# EAGLE design meaga relay (EAGLE 9.6.2)
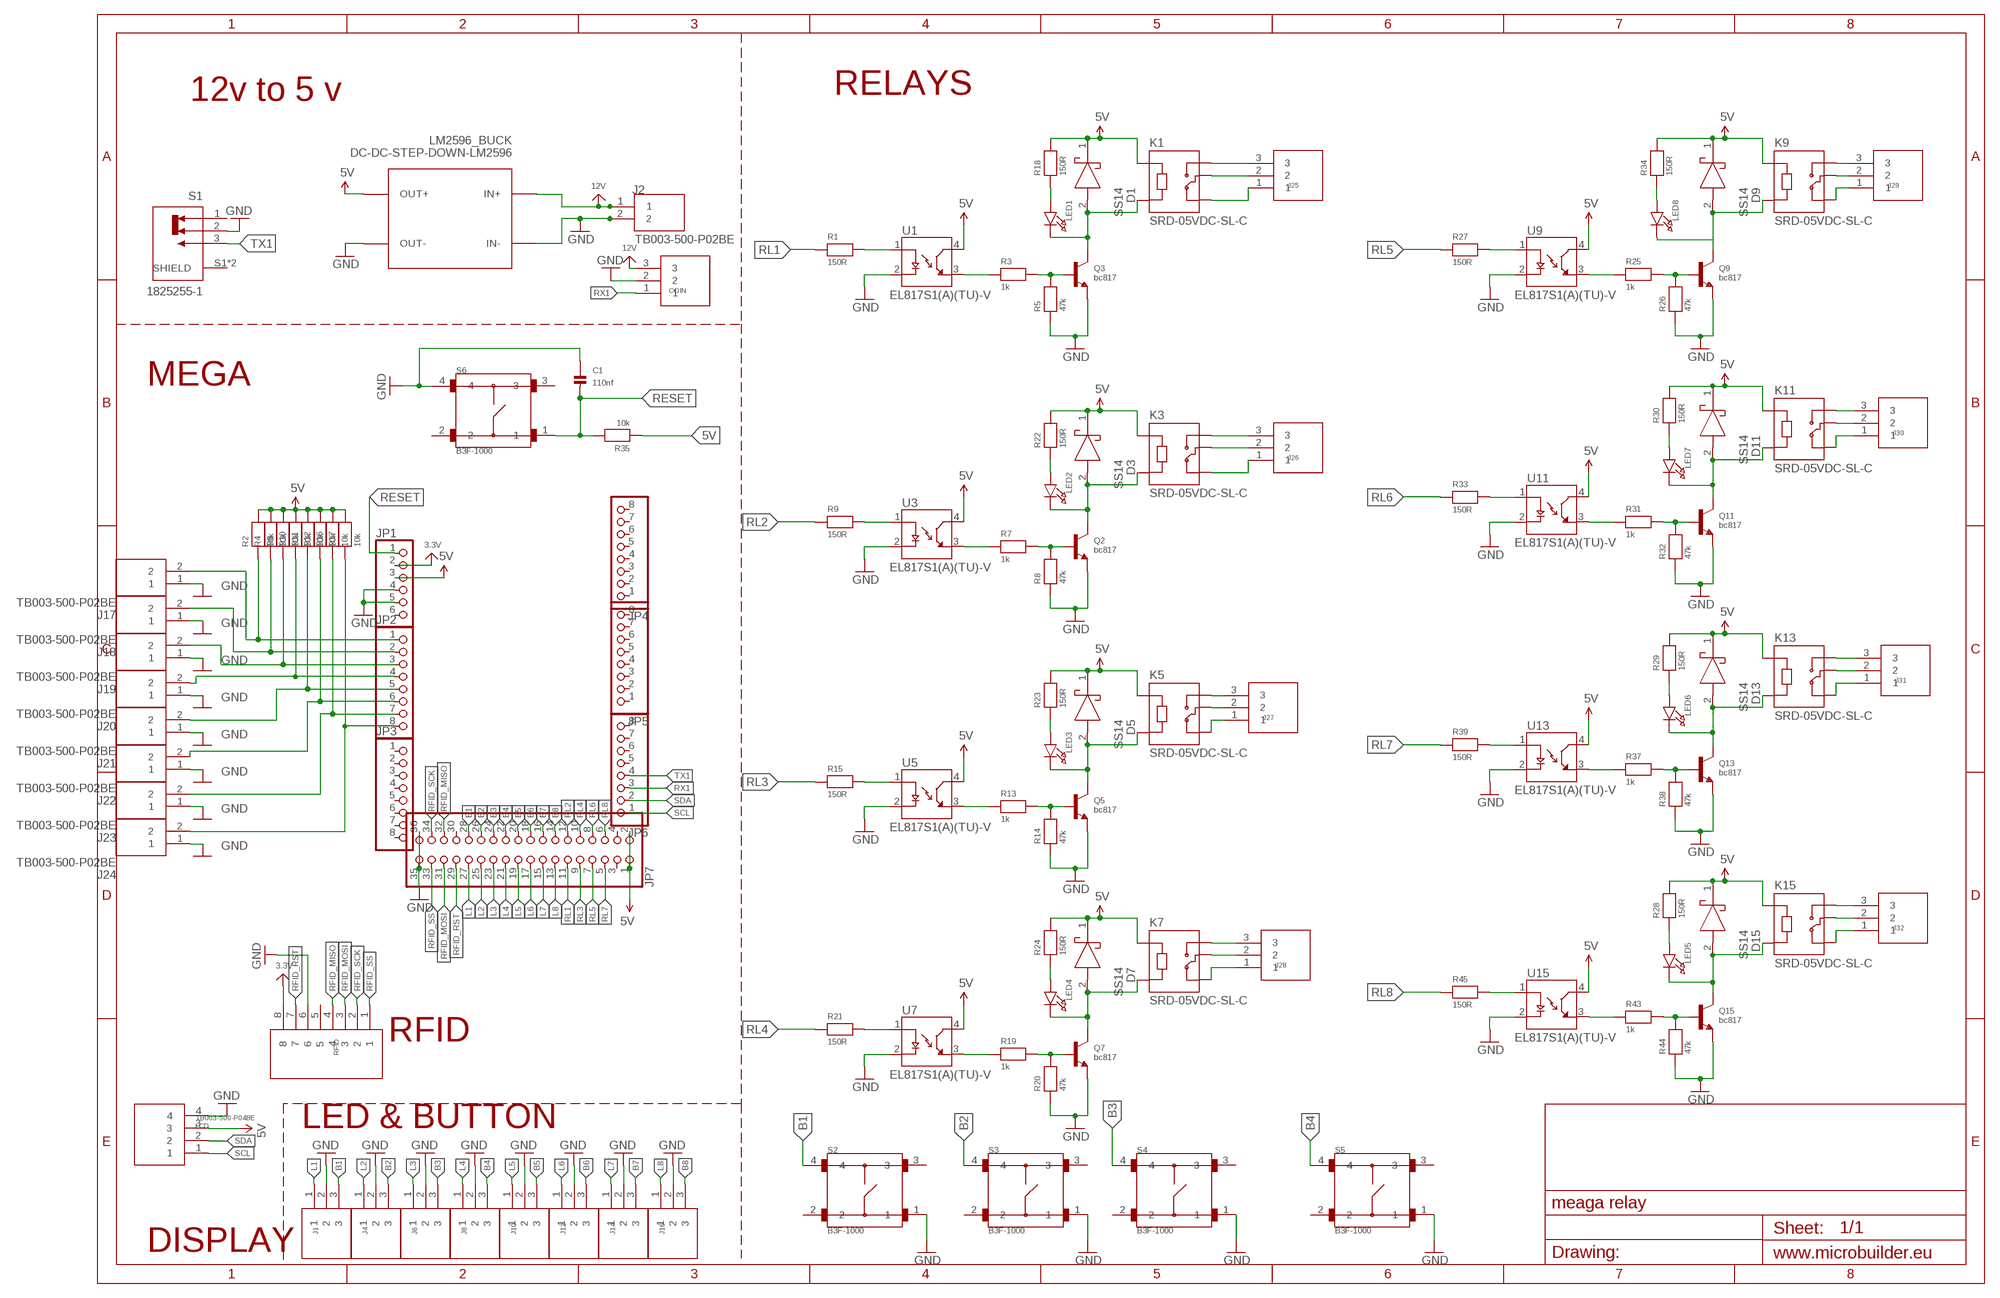
[diagram p0: schematic, sheet 1]

## Parts
C1  110nf  CAP_CERAMIC0603  [0603]
COIN  TB003-500-P03BE  [CUI_TB003-500-P03BE]
D1  SS14  [DIOM5227X270N]
D3  SS14  [DIOM5227X270N]
D5  SS14  [DIOM5227X270N]
D7  SS14  [DIOM5227X270N]
D9  SS14  [DIOM5227X270N]
D11  SS14  [DIOM5227X270N]
D13  SS14  [DIOM5227X270N]
D15  SS14  [DIOM5227X270N]
J1  TB003-500-P03BE  [CUI_TB003-500-P03BE]
J2  TB003-500-P02BE  [CUI_TB003-500-P02BE]
J4  TB003-500-P03BE  [CUI_TB003-500-P03BE]
J6  TB003-500-P03BE  [CUI_TB003-500-P03BE]
J8  TB003-500-P03BE  [CUI_TB003-500-P03BE]
J10  TB003-500-P03BE  [CUI_TB003-500-P03BE]
J12  TB003-500-P03BE  [CUI_TB003-500-P03BE]
J14  TB003-500-P03BE  [CUI_TB003-500-P03BE]
J16  TB003-500-P03BE  [CUI_TB003-500-P03BE]
J17  TB003-500-P02BE  [CUI_TB003-500-P02BE]
J18  TB003-500-P02BE  [CUI_TB003-500-P02BE]
J19  TB003-500-P02BE  [CUI_TB003-500-P02BE]
J20  TB003-500-P02BE  [CUI_TB003-500-P02BE]
J21  TB003-500-P02BE  [CUI_TB003-500-P02BE]
J22  TB003-500-P02BE  [CUI_TB003-500-P02BE]
J23  TB003-500-P02BE  [CUI_TB003-500-P02BE]
J24  TB003-500-P02BE  [CUI_TB003-500-P02BE]
J25  TB003-500-P03BE  [CUI_TB003-500-P03BE]
J26  TB003-500-P03BE  [CUI_TB003-500-P03BE]
J27  TB003-500-P03BE  [CUI_TB003-500-P03BE]
J28  TB003-500-P03BE  [CUI_TB003-500-P03BE]
J29  TB003-500-P03BE  [CUI_TB003-500-P03BE]
J30  TB003-500-P03BE  [CUI_TB003-500-P03BE]
J31  TB003-500-P03BE  [CUI_TB003-500-P03BE]
J32  TB003-500-P03BE  [CUI_TB003-500-P03BE]
JP1  PINHD-1X6  [1X06]
JP2  PINHD-1X8  [1X08]
JP3  PINHD-1X8  [1X08]
JP4  PINHD-1X8  [1X08]
JP5  PINHD-1X8  [1X08]
JP6  PINHD-1X8  [1X08]
JP7  PINHD-2X18  [2X18]
K1  SRD-05VDC-SL-C  [RELAY_SRD-05VDC-SL-C]
K3  SRD-05VDC-SL-C  [RELAY_SRD-05VDC-SL-C]
K5  SRD-05VDC-SL-C  [RELAY_SRD-05VDC-SL-C]
K7  SRD-05VDC-SL-C  [RELAY_SRD-05VDC-SL-C]
K9  SRD-05VDC-SL-C  [RELAY_SRD-05VDC-SL-C]
K11  SRD-05VDC-SL-C  [RELAY_SRD-05VDC-SL-C]
K13  SRD-05VDC-SL-C  [RELAY_SRD-05VDC-SL-C]
K15  SRD-05VDC-SL-C  [RELAY_SRD-05VDC-SL-C]
LCD  TB003-500-P04BE  [CUI_TB003-500-P04BE]
LED1  LED0603  [CHIPLED_0603]
LED2  LED0603  [CHIPLED_0603]
LED3  LED0603  [CHIPLED_0603]
LED4  LED0603  [CHIPLED_0603]
LED5  LED0603  [CHIPLED_0603]
LED6  LED0603  [CHIPLED_0603]
LED7  LED0603  [CHIPLED_0603]
LED8  LED0603  [CHIPLED_0603]
LM2596_BUCK  DC-DC-STEP-DOWN-LM2596  [DC-DC-STEP-DOWN-LM2596]
Q2  bc817  TRANSISTOR_NPN  [SOT23-R]
Q3  bc817  TRANSISTOR_NPN  [SOT23-R]
Q5  bc817  TRANSISTOR_NPN  [SOT23-R]
Q7  bc817  TRANSISTOR_NPN  [SOT23-R]
Q9  bc817  TRANSISTOR_NPN  [SOT23-R]
Q11  bc817  TRANSISTOR_NPN  [SOT23-R]
Q13  bc817  TRANSISTOR_NPN  [SOT23-R]
Q15  bc817  TRANSISTOR_NPN  [SOT23-R]
R1  150R  RESISTOR0603  [0603]
R2  10k  RESISTOR0603  [0603]
R3  1k  RESISTOR0603  [0603]
R4  10k  RESISTOR0603  [0603]
R5  47k  RESISTOR0603  [0603]
R6  10k  RESISTOR0603  [0603]
R7  1k  RESISTOR0603  [0603]
R8  47k  RESISTOR0603  [0603]
R9  150R  RESISTOR0603  [0603]
R10  10k  RESISTOR0603  [0603]
R11  10k  RESISTOR0603  [0603]
R12  10k  RESISTOR0603  [0603]
R13  1k  RESISTOR0603  [0603]
R14  47k  RESISTOR0603  [0603]
R15  150R  RESISTOR0603  [0603]
R16  10k  RESISTOR0603  [0603]
R17  10k  RESISTOR0603  [0603]
R18  150R  RESISTOR0402  [0402]
R19  1k  RESISTOR0603  [0603]
R20  47k  RESISTOR0603  [0603]
R21  150R  RESISTOR0603  [0603]
R22  150R  RESISTOR0402  [0402]
R23  150R  RESISTOR0402  [0402]
R24  150R  RESISTOR0402  [0402]
R25  1k  RESISTOR0603  [0603]
R26  47k  RESISTOR0603  [0603]
R27  150R  RESISTOR0603  [0603]
R28  150R  RESISTOR0402  [0402]
R29  150R  RESISTOR0402  [0402]
R30  150R  RESISTOR0402  [0402]
R31  1k  RESISTOR0603  [0603]
R32  47k  RESISTOR0603  [0603]
R33  150R  RESISTOR0603  [0603]
R34  150R  RESISTOR0402  [0402]
R35  10k  RESISTOR0402  [0402]
R37  1k  RESISTOR0603  [0603]
R38  47k  RESISTOR0603  [0603]
R39  150R  RESISTOR0603  [0603]
R43  1k  RESISTOR0603  [0603]
R44  47k  RESISTOR0603  [0603]
R45  150R  RESISTOR0603  [0603]
RFID  TB003-500-P08BE  [CUI_TB003-500-P08BE]
S1  1825255-1  [SW_1825255-1]
S2  B3F-1000  [SW_B3F-1000]
S3  B3F-1000  [SW_B3F-1000]
S4  B3F-1000  [SW_B3F-1000]
S5  B3F-1000  [SW_B3F-1000]
S6  B3F-1000  [SW_B3F-1000]
U1  EL817S1(A)(TU)-V  [SOIC254P1030X390-4N_EL817S1(A)(TU)-V]
U3  EL817S1(A)(TU)-V  [SOIC254P1030X390-4N_EL817S1(A)(TU)-V]
U5  EL817S1(A)(TU)-V  [SOIC254P1030X390-4N_EL817S1(A)(TU)-V]
U7  EL817S1(A)(TU)-V  [SOIC254P1030X390-4N_EL817S1(A)(TU)-V]
U9  EL817S1(A)(TU)-V  [SOIC254P1030X390-4N_EL817S1(A)(TU)-V]
U11  EL817S1(A)(TU)-V  [SOIC254P1030X390-4N_EL817S1(A)(TU)-V]
U13  EL817S1(A)(TU)-V  [SOIC254P1030X390-4N_EL817S1(A)(TU)-V]
U15  EL817S1(A)(TU)-V  [SOIC254P1030X390-4N_EL817S1(A)(TU)-V]

## Nets
3.3V: JP1.2 RFID.8
5V: D1.1(K) D3.1(K) D5.1(K) D7.1(K) D9.1(K) D11.1(K) D13.1(K) D15.1(K) JP1.3 JP7.1 JP7.2 K1.A1 K3.A1 K5.A1 K7.A1 K9.A1 K11.A1 K13.A1 K15.A1 LCD.3 LM2596_BUCK.OUT+ R2.2 R4.2 R6.2 R10.2 R11.2 R12.2 R16.2 R17.2 R18.2 R22.2 R23.2 R24.2 R28.2 R29.2 R30.2 R34.2 R35.1 U1.4(CT) U3.4(CT) U5.4(CT) U7.4(CT) U9.4(CT) U11.4(CT) U13.4(CT) U15.4(CT)
12V: COIN.3 J2.1 LM2596_BUCK.IN+
B1: J1.3 JP7.28 S2.4
B2: J4.3 JP7.26 S3.4
B3: J6.3 JP7.24 S4.4
B4: J8.3 JP7.22 S5.4
B5: J10.3 JP7.20
B6: J12.3 JP7.18
B7: J14.3 JP7.16
B8: J16.3 JP7.14
GND: C1.1 COIN.2 J1.2 J2.2 J4.2 J6.2 J8.2 J10.2 J12.2 J14.2 J16.2 J17.1 J18.1 J19.1 J20.1 J21.1 J22.1 J23.1 J24.1 JP1.4 JP1.5 JP7.35 JP7.36 LCD.4 LM2596_BUCK.IN- LM2596_BUCK.OUT- Q2.2(E) Q3.2(E) Q5.2(E) Q7.2(E) Q9.2(E) Q11.2(E) Q13.2(E) Q15.2(E) R5.1 R8.1 R14.1 R20.1 R26.1 R32.1 R38.1 R44.1 RFID.6 S1.2 S2.1 S3.1 S4.1 S5.1 S6.4 U1.2(C) U3.2(C) U5.2(C) U7.2(C) U9.2(C) U11.2(C) U13.2(C) U15.2(C)
L1: J1.1 JP7.27
L2: J4.1 JP7.25
L3: J6.1 JP7.23
L4: J8.1 JP7.21
L5: J10.1 JP7.19
L6: J12.1 JP7.17
L7: J14.1 JP7.15
L8: J16.1 JP7.13
N$1: R3.1 U1.3(ET)
N$2: R1.2 U1.1(A)
N$3: J25.1 K1.NC
N$4: J17.2 JP2.1 R2.1
N$5: J18.2 JP2.2 R4.1
N$6: J19.2 JP2.3 R6.1
N$7: J20.2 JP2.4 R10.1
N$8: J21.2 JP2.5 R11.1
N$9: D1.2(A) K1.A2 LED1.C Q3.3(C)
N$10: J22.2 JP2.6 R12.1
N$11: D3.2(A) K3.A2 LED2.C Q2.3(C)
N$12: Q2.1(B) R7.2 R8.2
N$13: J26.3 K3.NO
N$14: R7.1 U3.3(ET)
N$15: Q3.1(B) R3.2 R5.2
N$16: R9.2 U3.1(A)
N$17: J26.1 K3.NC
N$18: J25.3 K1.NO
N$19: J23.2 JP2.7 R16.1
N$20: J24.2 JP2.8 R17.1
N$21: J27.1 K5.NC
N$22: J28.1 K7.NC
N$23: J25.2 K1.COM
N$24: J26.2 K3.COM
N$25: D5.2(A) K5.A2 LED3.C Q5.3(C)
N$26: Q5.1(B) R13.2 R14.2
N$27: J27.3 K5.NO
N$28: R13.1 U5.3(ET)
N$29: R15.2 U5.1(A)
N$30: J32.1 K15.NC
N$31: J29.2 K9.COM
N$32: J30.2 K11.COM
N$33: J32.2 K15.COM
N$34: J31.2 K13.COM
N$35: J28.2 K7.COM
N$36: J27.2 K5.COM
N$37: D7.2(A) K7.A2 LED4.C Q7.3(C)
N$38: Q7.1(B) R19.2 R20.2
N$39: J28.3 K7.NO
N$40: R19.1 U7.3(ET)
N$41: R21.2 U7.1(A)
N$42: J31.1 K13.NC
N$43: J30.1 K11.NC
N$44: J29.1 K9.NC
N$45: LED2.A R22.1
N$46: LED3.A R23.1
N$47: LED4.A R24.1
N$48: LED5.A R28.1
N$49: D9.2(A) K9.A2 LED8.C Q9.3(C)
N$50: Q9.1(B) R25.2 R26.2
N$51: J29.3 K9.NO
N$52: R25.1 U9.3(ET)
N$53: R27.2 U9.1(A)
N$54: LED6.A R29.1
N$55: LED7.A R30.1
N$56: LED8.A R34.1
N$57: LED1.A R18.1
N$61: D11.2(A) K11.A2 LED7.C Q11.3(C)
N$62: Q11.1(B) R31.2 R32.2
N$63: J30.3 K11.NO
N$64: R31.1 U11.3(ET)
N$65: R33.2 U11.1(A)
N$73: D13.2(A) K13.A2 LED6.C Q13.3(C)
N$74: Q13.1(B) R37.2 R38.2
N$75: J31.3 K13.NO
N$76: R37.1 U13.3(ET)
N$77: R39.2 U13.1(A)
N$85: D15.2(A) K15.A2 LED5.C Q15.3(C)
N$86: Q15.1(B) R43.2 R44.2
N$87: J32.3 K15.NO
N$88: R43.1 U15.3(ET)
N$89: R45.2 U15.1(A)
RESET: C1.2 JP1.1 R35.2 S6.1
RFID_MISO: JP7.32 RFID.4
RFID_MOSI: JP7.31 RFID.3
RFID_RST: JP7.29 RFID.7
RFID_SCK: JP7.34 RFID.2
RFID_SS: JP7.33 RFID.1
RL1: JP7.11 R1.1
RL2: JP7.12 R9.1
RL3: JP7.9 R15.1
RL4: JP7.10 R21.1
RL5: JP7.7 R27.1
RL6: JP7.8 R33.1
RL7: JP7.5 R39.1
RL8: JP7.6 R45.1
RX1: COIN.1 JP6.3
SCL: JP6.1 LCD.1
SDA: JP6.2 LCD.2
TX1: JP6.4 S1.3
Unconnected: JP1.6 JP3.1 JP3.2 JP3.3 JP3.4 JP3.5 JP3.6 JP3.7 JP3.8 JP4.1 JP4.2 JP4.3 JP4.4 JP4.5 JP4.6 JP4.7 JP4.8 JP5.1 JP5.2 JP5.3 JP5.4 JP5.5 JP5.6 JP5.7 JP5.8 JP6.5 JP6.6 JP6.7 JP6.8 JP7.3 JP7.4 JP7.30 RFID.5 S1.1 S1.S1(SHIELD) S1.S2(SHIELD) S2.2 S2.3 S3.2 S3.3 S4.2 S4.3 S5.2 S5.3 S6.2 S6.3

## Notes on the sheet
- 12v to 5 v | RELAYS
- MEGA
- RFID
- LED & BUTTON
- DISPLAY

## Library data of the parts
C1 = microbuilder:CAP_CERAMIC: Ceramic Capacitors 0402 - 0402 Surface Mount Capacitors 16pF 50V 5% [Digikey: 445-4899-2-ND] 18pF 50V 5% [Digikey: 490-1281-2-ND] 22pF 50V 5% [Digikey: 490-1283-2-ND] 68pF 50V 5% [Digikey: 490-1289-2-ND] 0.1uF 10V 10% [Digikey: 490-1318-2-ND] 1.0uF 6.3V 10% [Digikey: 490-1320-2-ND] 0603 - 0603 Surface Mount Capacitors 16 pF 50V 5% [Digikey: 445-5051-2-ND] 22 pF 50V [Digikey: PCC220ACVTR-ND] 33 pF 50V 5% [Digikey: 490-1415-1-ND] 56pF 50V 5% [Digikey: 490-1421-1-ND] 220pF 50V 5% [Digikey: 445-1285-1-ND] 680 pF 50V 2200 pF 50V 5% C0G [Digikey: 445-1297-1-ND] 5600 pF 100V 5% X7R [Digikey: 478-3711-1-ND] 0.1 µF 25V 10% [Digikey: PCC2277TR-ND] 0.22 µF 16V 10% X7R [Digikey: 445-1318-1-ND] 1.0 µF 25V 10% [Digikey: 445-5146-2-ND] 0603 - RF Specific 3pF 250V +/-0.1pF RF [Digikey: 712-1347-1-ND] 18 pF 250V 5% [Digikey: 478-3505-1-ND or 712-1322-1-ND] 56 pF 250V 5% C0G RF [Digikey: 490-4867-1-ND] 68 pF 250V RF [Digikey: 490-4868-1-ND] 0805 - 0805 Surface Mount Capacitors 220 pF 250V 2% RF Ceramic Capacitor [Digikey: 712-1398-1-ND] 1000 pF 50V 2% NP0 Ceramic Capacitor [Digikey: 478-3760-1-ND] 0.1 µF 25V 10% Ceramic Capacitor [Digikey: PCC1828TR-ND] 1.0 µF 16V 10% Ceramic Capacitor[Digikey: 490-1691-2-ND] 10.0 µF 10V 10% Ceramic Capacitor[Digikey: 709-1228-1-ND] 10.0 uF 16V 10% Ceramic Capacitor [Digikey: 478-5165-2-ND] 47 uF 6.3V 20% Ceramic Capacitor [Digikey: 587-1779-1-ND or 399-5506-1-ND] 1206 - 1206 Surface Mount Capacitors 47uF 10V 20% Ceramic Capacitor [Digikey: 490-5528-1-ND or 399-5508-1-ND or 445-6010-1-ND] 100uF 6.3V -20%, +80% Y5V Ceramic Capacitor (Digikey: 490-4512-1-ND, Mouser: 81-GRM31CF50J107ZE1L)
COIN J1 J4 J6 J8 J10 J12 J14 J16 J25-J32 = TB003-500-P03BE:TB003-500-P03BE: Check prices <https://pricing.snapeda.com/parts/TB003-500-P03BE/CUI%20Devices/view-part?ref=eda>; AVAILABILITY: Good; CUI_PURCHASE_URL: https://www.cuidevices.com/product/interconnect/connectors/terminal-blocks/tb003-500-series?utm_source=snapeda.com&utm_medium=referral&utm_campaign=snapedaBOM; DESCRIPTION: 2~24 Poles, Screw Type, Horizontal, 5.0 Pitch, 26~14 (AWG), Terminal Block Connector; MF: CUI Devices; MP: TB003-500-P03BE; PACKAGE: None; PRICE: None; PURCHASE-URL: https://pricing.snapeda.com/search/part/TB003-500-P03BE/?ref=eda
D1 D3 D5 D7 D9 D11 D13 D15 = SS14:SS14: 1.0 A Schottky Barrier Rectifiers Source: Datasheet <http://www.onsemi.com/pub/Collateral/SS19-D.pdf>; DESCRIPTION: 1.0 A Schottky Barrier Rectifiers; HEIGHT: 2.7mm; MANUFACTURER_NAME: ON Semiconductor; MANUFACTURER_PART_NUMBER: SS14; MOUSER_PART_NUMBER: 512-SS14; MOUSER_PRICE-STOCK: https://www.mouser.com/Search/Refine.aspx?Keyword=512-SS14; RS_PART_NUMBER: 7390467P; RS_PRICE-STOCK: http://uk.rs-online.com/web/p/products/7390467P
J2 J17-J24 = TB003-500-P02BE:TB003-500-P02BE: Check prices <https://pricing.snapeda.com/parts/TB003-500-P02BE/CUI%20Devices/view-part?ref=eda>; AVAILABILITY: Good; CUI_PURCHASE_URL: https://www.cuidevices.com/product/interconnect/connectors/terminal-blocks/tb003-500-series?utm_source=snapeda.com&utm_medium=referral&utm_campaign=snapedaBOM; DESCRIPTION: 2~24 Poles, Screw Type, Horizontal, 5.0 Pitch, 26~14 (AWG), Terminal Block Connector; MF: CUI Devices; MP: TB003-500-P02BE; PACKAGE: None; PRICE: None; PURCHASE-URL: https://pricing.snapeda.com/search/part/TB003-500-P02BE/?ref=eda
JP1 = pinhead:PINHD-1X6: PIN HEADER
JP2-JP6 = pinhead:PINHD-1X8: PIN HEADER
JP7 = pinhead:PINHD-2X18: PIN HEADER
K1 K3 K5 K7 K9 K11 K13 K15 = SRD-05VDC-SL-C:SRD-05VDC-SL-C: 5V Trigger Relay Module For Arduino And Raspberry Pi 5V Trigger Relay Module For Arduino And Raspberry Pi; AVAILABILITY: Unavailable; DESCRIPTION: 5V Trigger Relay Module For Arduino And Raspberry Pi 5V Trigger Relay Module For Arduino And Raspberry Pi; MF: Songle Relay; MP: SRD-05VDC-SL-C; PACKAGE: None; PRICE: None
LCD = TB003-500-P04BE:TB003-500-P04BE: Check prices <https://pricing.snapeda.com/parts/TB003-500-P04BE/CUI%20Devices/view-part?ref=eda>; AVAILABILITY: Good; CUI_PURCHASE_URL: https://www.cuidevices.com/product/interconnect/connectors/terminal-blocks/tb003-500-series?utm_source=snapeda.com&utm_medium=referral&utm_campaign=snapedaBOM; DESCRIPTION: 2~24 Poles, Screw Type, Horizontal, 5.0 Pitch, 26~14 (AWG), Terminal Block Connector; MF: CUI Devices; MP: TB003-500-P04BE; PACKAGE: None; PRICE: None; PURCHASE-URL: https://pricing.snapeda.com/search/part/TB003-500-P04BE/?ref=eda
LED1-LED8 = microbuilder:LED: LED 0603 - 0603 Surface Mount Package 2mA: Green LED - Low Power (3.9mcd, 2ma, 1.7Vf) - Digikey: 475-2709-2-ND Orange LED - Low Power (9.8mcd, 2ma, 1.8Vf) - Digikey: 475-1194-2-ND Red LED - Low Power (5mcd, 2ma, 1.8Vf) - Digikey: 475-1195-2-ND Yellow LED - Low Power (7mcd, 2ma, 1.8Vf) - Digikey: 475-1196-2-ND 5mA: Blue LED - Low Power (17mcd, 5ma, 2.9Vf) - Digikey: LNJ937W8CRACT-ND 0805 - 0805 Surface Mount Package 2mA: Red LED (8.8mcd, 2mA, 1.8Vf, Clear) - Low Power [Digikey: 475-2510-1-ND] Green LED (5mcd, 2mA, 1.8Vf, Clear) - Low Power [Digikey: 475-2730-1-ND] Yellow LED (11.3mcd, 2mA, 1.8Vf, Clear) - Low Power [Digikey: 475-2555-1-ND] 20mA: Red LED (104mcd, 20mA, Diffused) - LS R976 [Digikey: 475-1278-6-ND] Red LED (12mcd, 20mA, 2.0Vf, Clear) - APT2012EC [Digikey: 754-1128-1-ND] Green LED (15mcd, 20mA, 2.2Vf, Clear) - APT2012GC [Digikey: 754-1131-1-ND] Orange LED (160mcd, 20mA, 2.1Vf, Clear) - APT2012SECK [Digikey: 754-1130-1-ND] 1206 - 1206 Surface Mount Package Green LED (26mcd, 20mA, Diffused) - LG N971 [Digikey: 475-1407-6-ND] Red LED (15mcd, 20mA, Diffused) - LH N974 [Digikey: 475-1416-6-ND]
LM2596_BUCK = diy-modules:DC-DC-STEP-DOWN-LM2596: DC/DC Step-Down Regulator based on LM2596-ADJ chip LM2596 datasheet available here: http://www.ti.com/lit/ds/symlink/lm2596.pdf Click here to find device on ebay.com <http://www.ebay.com/sch/lm2596+power+regulator>
Q2 Q3 Q5 Q7 Q9 Q11 Q13 Q15 = microbuilder:TRANSISTOR_NPN: NPN Transistor Transistor (NPN) 500mA 45V - BC817 [Digikey: 568-1631-1-ND] Transistor (NPN) 500mA 45V - BC817,215 [Mouser: 771-BC817-T/R] SOT23-R - SOT23 footprint optimised for use with solder paste and reflow ovens. SOT23-W - SOT23 footprint optimised for hand-soldering (larger pads).
R1-R35 R37-R39 R43-R45 = microbuilder:RESISTOR: Resistors 0402 - 0402 Surface Mount Package 22 Ohm 1% 1/16W [Digikey: 311-22.0LRTR-ND] 33 Ohm 5% 1/16W 1.0K 5% 1/16W 1.5K 5% 1/16W 2.0K 1% 1/16W 10.0K 1% 1/16W [Digikey: 311-10.0KLRTR-ND] 10.0K 5% 1/16W [Digikey: RMCF0402JT10K0TR-ND] 12.1K 1% 1/16W [Digikey: 311-22.0LRTR-ND] 100.0K 5% 1/16W 0603 - 0603 Surface Mount Package 0 Ohm 1/10 Watt 1% Resistor 15 Ohm 1/10 Watt 1% Resistor 33 Ohm 1/10 Watt 1% Resistor 49.9 Ohm 1/10 Watt 1% Resistor 100 Ohm 1/10 Watt 1% Resistor 150 Ohm 1/10 Watt 1% Resistor 240 Ohm 1/10 Watt 1% Resistor 390 Ohm 1/10 Watt 1% Resistor 560 Ohm 1/10 Watt 1% Resistor 680 Ohm 1/10 Watt 1% Resistor 750 Ohm 1/10 Watt 1% Resistor 1.0K Ohm 1/10 Watt 1% Resistor 1.5K Ohm 1/10 Watt 1% Resistor 2.0K Ohm 1/10 Watt 1% Resistor 2.2K Ohm 1/10 Watt 1% Resistor 3.3K Ohm 1/10 Watt 1% Resistor 4.7K Ohm 1/10 Watt 1% Resistor 10.0K Ohm 1/10 Watt 1% Resistor 12.0K Ohm 1/10 Watt 1% Resistor 12.1K Ohm 1/10 Watt 1% Resistor 20.0K Ohm 1/10 Watt 1% Resistor 33.0K Ohm 1/10 Watt 1% Resistor 100.0K Ohm 1/10 Watt 1% Resistor 0805 - 0805 Surface Mount Package 0 Ohm 1/8 Watt 1% Resistor 33 Ohm 1/8 Watt 1% Resistor 100 Ohm 1/8 Watt 1% Resistor 150 Ohm 1/8 Watt 1% Resistor 200 Ohm 1/8 Watt 1% Resistor 240 Ohm 1/8 Watt 1% Resistor 330 Ohm 1/8 Watt 1% Resistor 390 Ohm 1/8 Watt 1% Resistor 470 Ohm 1/8 Watt 1% Resistor 1.0K Ohm 1/8 Watt 1% Resistor 1.5K Ohm 1/8 Watt 1% Resistor 2.0K Ohm 1/8 Watt 1% Resistor 4.7K Ohm 1/8 Watt 1% Resistor 5.1K Ohm 1/8 Watt 1% Resistor 5.6K Ohm 1/8 Watt 1% Resistor 10.0K Ohm 1/8 Watt 1% Resistor 22.0K Ohm 1/8 Watt 1% Resistor 33.0K Ohm 1/8 Watt 1% Resistor 100K Ohm 1/8 Watt 1% Resistor 1206 - 1206 Surface Mount Package 2012 - 2010 Surface Mount Package 0.11 Ohm 1/2 Watt 1% Resistor - Digikey: RHM.11UCT-ND
RFID = TB003-500-P08BE:TB003-500-P08BE: Check prices <https://pricing.snapeda.com/parts/TB003-500-P08BE/CUI%20Devices/view-part?ref=eda>; AVAILABILITY: Good; CUI_PURCHASE_URL: https://www.cuidevices.com/product/interconnect/connectors/terminal-blocks/tb003-500-series?utm_source=snapeda.com&utm_medium=referral&utm_campaign=snapedaBOM; DESCRIPTION: 2~24 Poles, Screw Type, Horizontal, 5.0 Pitch, 26~14 (AWG), Terminal Block Connector; MF: CUI Devices; MP: TB003-500-P08BE; PACKAGE: None; PRICE: None; PURCHASE-URL: https://pricing.snapeda.com/search/part/TB003-500-P08BE/?ref=eda
S1 = 1825255-1:1825255-1: Switch Slide ON None ON SPDT Top Slide 0.3A 125VAC PC Pins Thru-Hole Tray; COMMENT: 1825255-1; DESCRIPTION: Switch Slide ON None ON SPDT Top Slide 0.3A 125VAC PC Pins Thru-Hole Tray; DIGI-KEY_PART_NUMBER: 450-1567-ND; MF: TE Connectivity; MP: 1825255-1; PACKAGE: Custom Package TE Connectivity; PURCHASE-URL: https://pricing.snapeda.com/search/part/1825255-1/?ref=eda
S2-S6 = B3F-1000:B3F-1000: Switch, FLUX TIGHT MECHANICAL KEYSwitch, , 50MA@24VDC, NO GROUND TERM., FLAT PLUNG Check prices <https://pricing.snapeda.com/parts/B3F-1000/Omron/view-part?ref=eda>; AVAILABILITY: Warning; DESCRIPTION: Tactile Switch SPST-NO Top Actuated Through Hole; MF: Omron; MP: B3F-1000; PACKAGE: None; PRICE: None; PURCHASE-URL: https://pricing.snapeda.com/search/part/B3F-1000/?ref=eda
U1 U3 U5 U7 U9 U11 U13 U15 = EL817S1_A__TU_-V:EL817S1(A)(TU)-V: Optoisoltr 5kv Transistor 4-Smd; DESCRIPTION: Optoisolator Transistor Output 5000Vrms 1 Channel 4-SMD; DIGI-KEY_PART_NUMBER: EL817S1(A)(TU)-V-ND; MF: Everlight Electronics; MP: EL817S1(A)(TU)-V; PACKAGE: SMD-4 Everlight Electronics Co Ltd

## Net classes
0 default: width 0.203 mm, drill 0.406 mm, clearance 0.203 mm

## Board
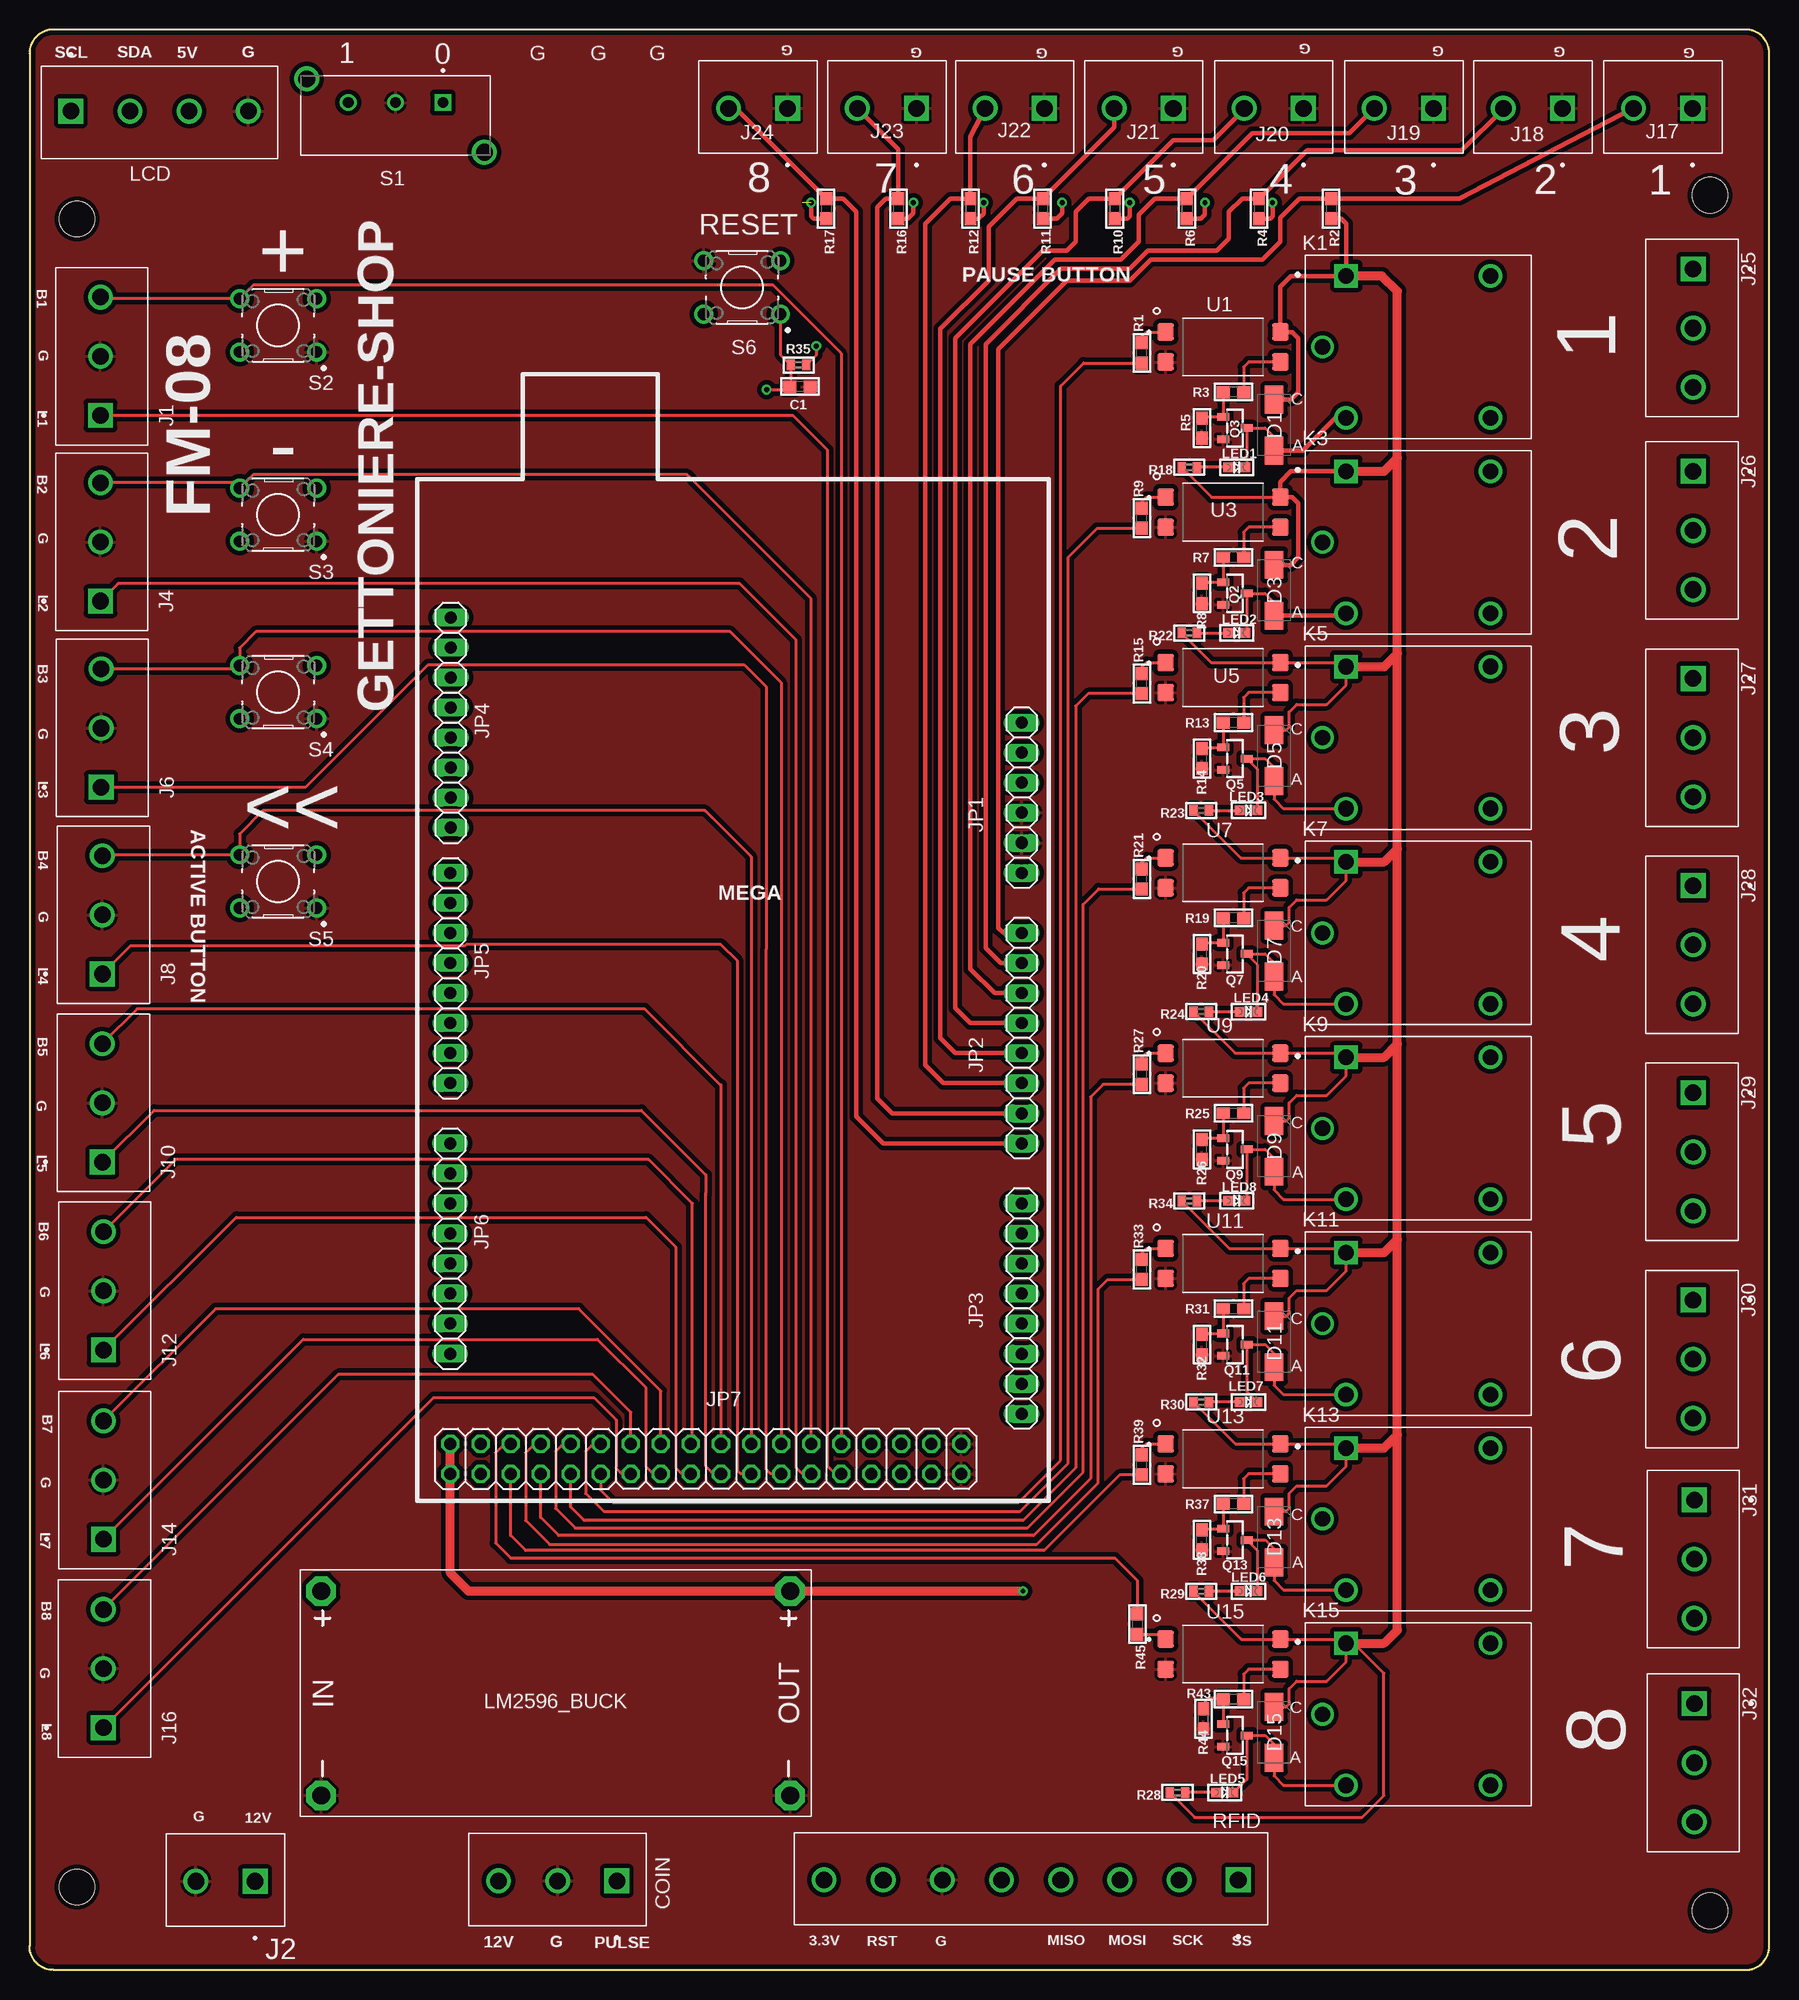
[diagram p1: board, top side]
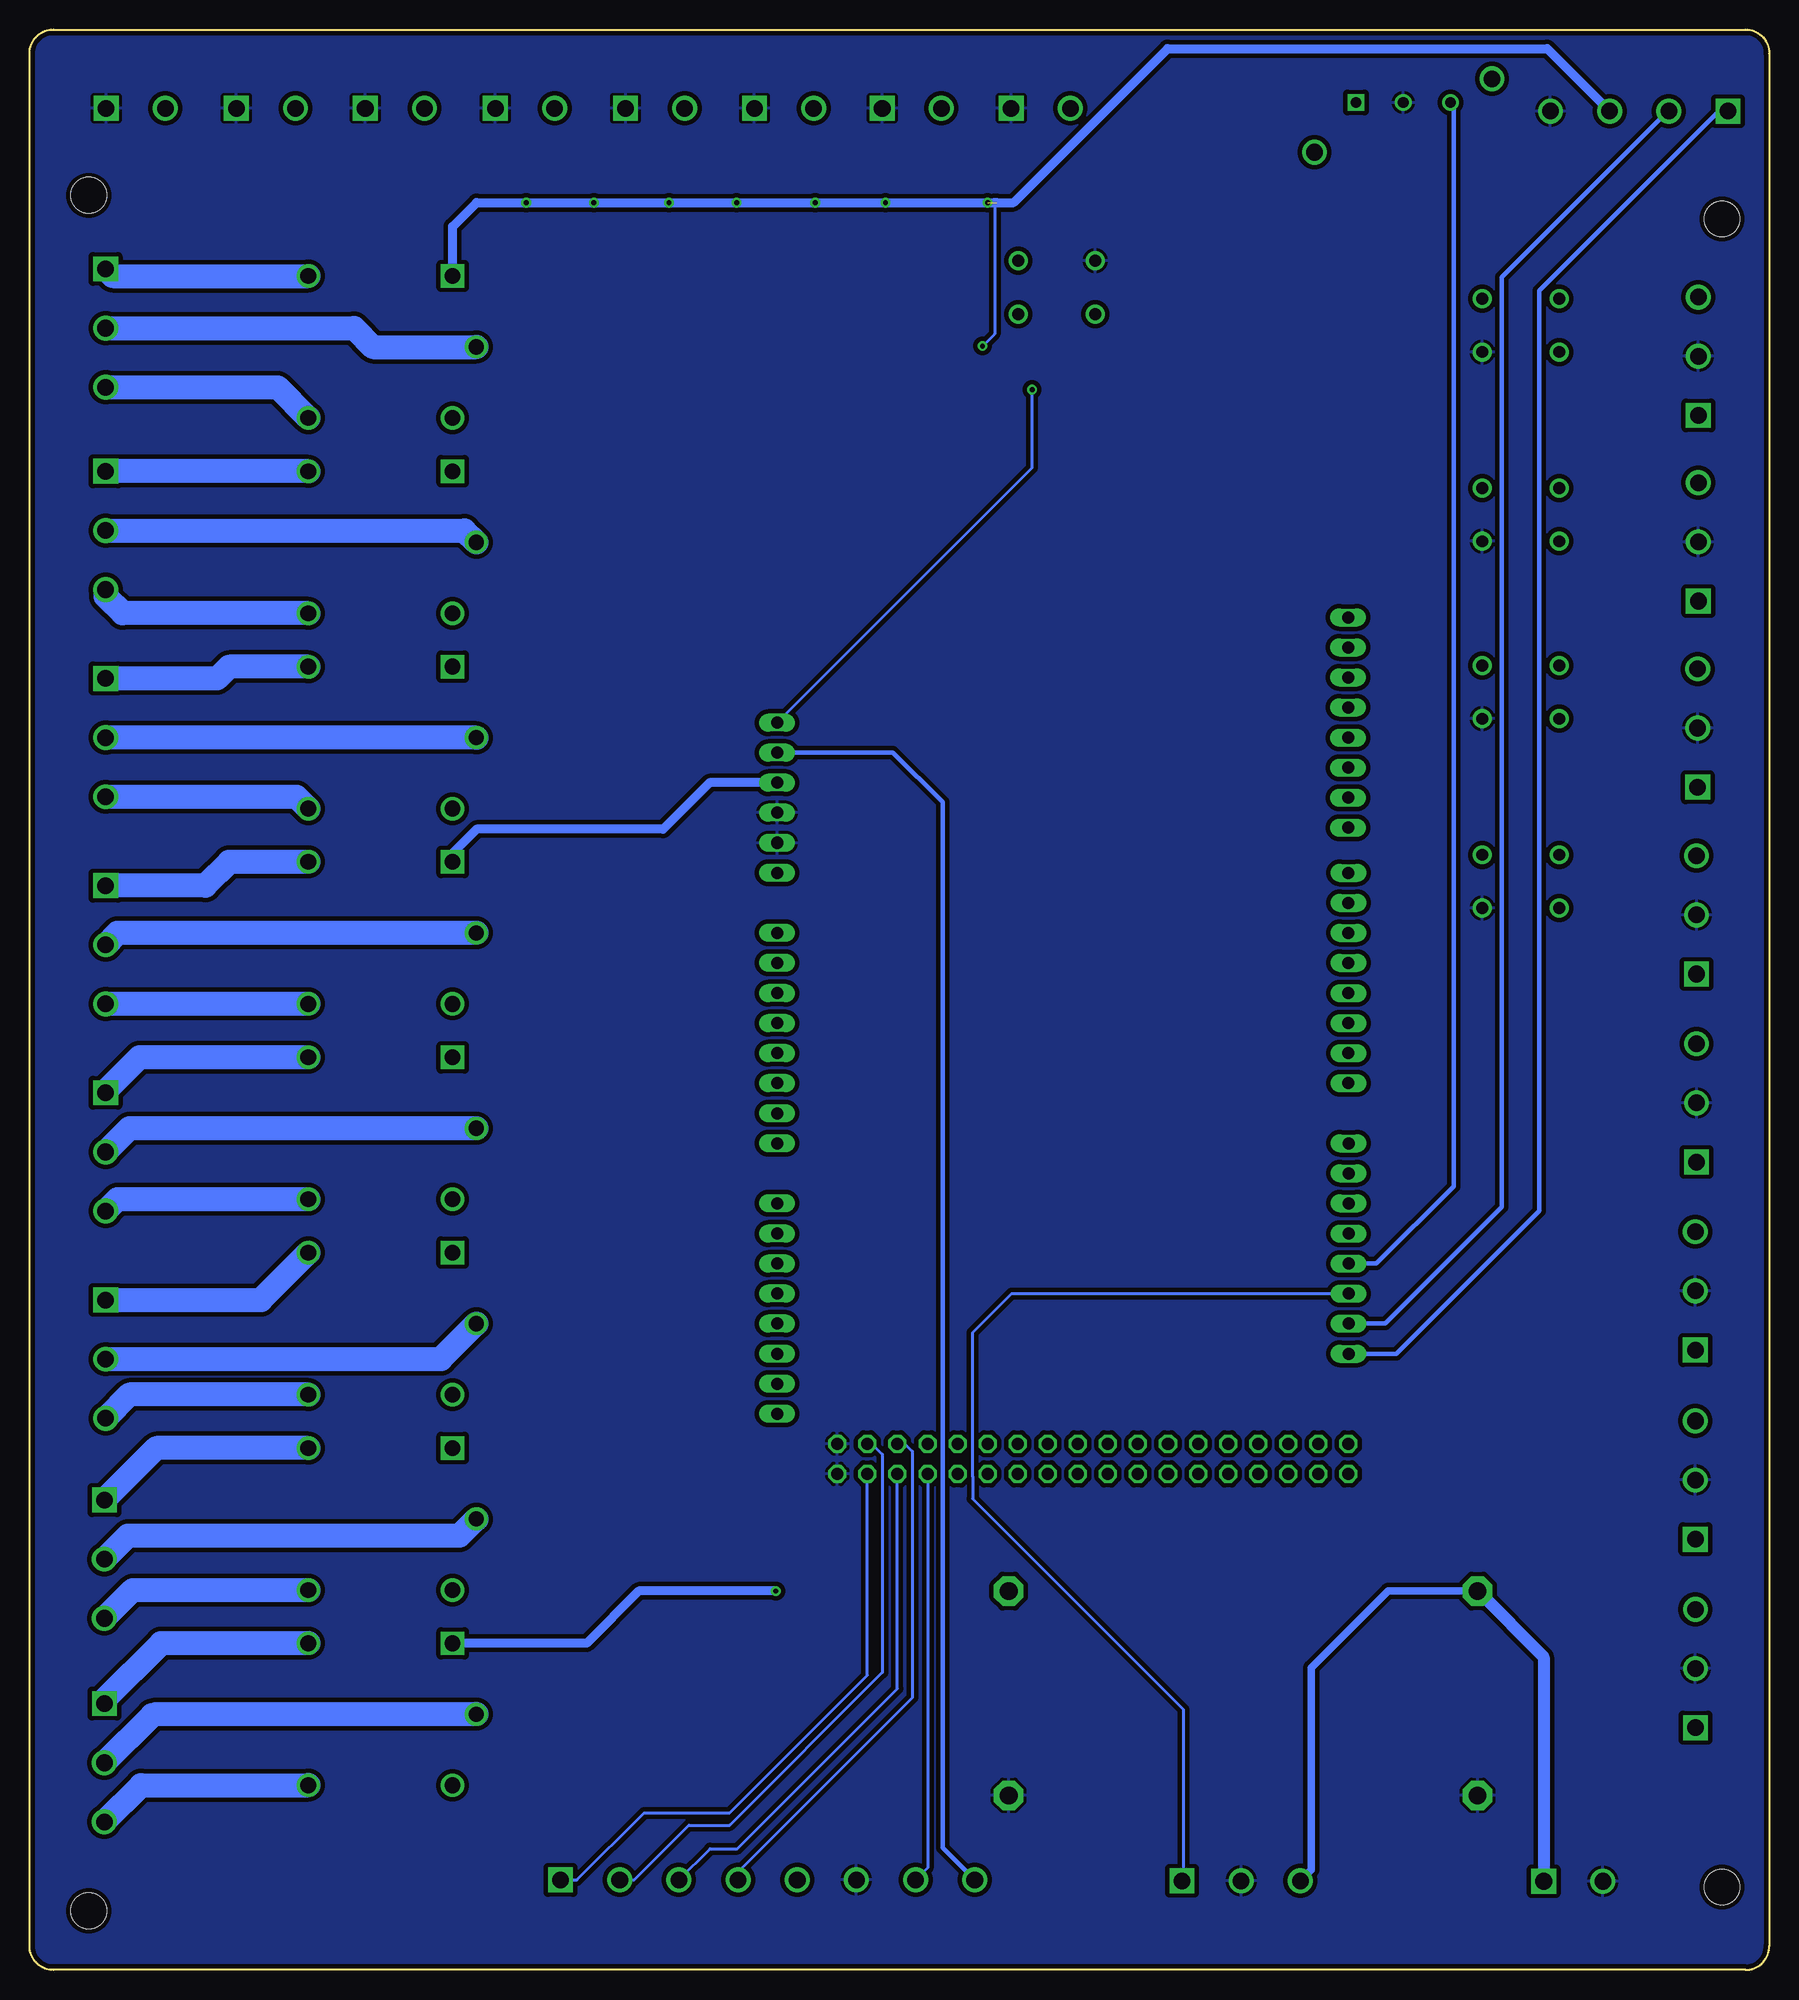
[diagram p2: board, bottom side, seen from below]

Size 147 x 164 mm. Coordinates in mm from the lower left corner, seen from the top.
Outline: 0,162 0,2 arc90 2,0 145,0 arc90 147,2 147,162 arc90 145,164 2,164 arc90 0,162
Copper layers (1*16): Top 0.035mm / dielectric 1.5mm / Bottom 0.035mm
Design rules "default *": minimum track width 6mil, minimum drill 0.32mm, track to track 6mil, track to pad 6mil, pad to pad 6mil, via to via 6mil, smd to smd 6mil, copper to edge 10mil, drill to drill 6mil, minimum pad ring 10mil, minimum via ring 8mil, stop-mask expansion 4mil, vias tented up to drill 20mil, thermal gap 10mil
Holes 3 mm at 4,148 142,150 142,5 4,7

### Footprints (pad centres in the part's own frame; a part is rotated, then mirrored left to right if it is on the bottom)
0603 = smd 1.1 x 1: 1 -0.85,0; 2 0.85,0
CUI_TB003-500-P03BE = drill 1.4 square: 1 0,0 | drill 1.4: 2 5,0; 3 10,0
DIOM5227X270N = smd 2.35 x 1.55: 1 -2.15,0; 2 2.15,0
CUI_TB003-500-P02BE = drill 1.4 square: 1 0,0 | drill 1.4: 2 5,0
1X06 = drill 1.016 long: 1 -6.35,0; 2 -3.81,0; 3 -1.27,0; 4 1.27,0; 5 3.81,0; 6 6.35,0
1X08 = drill 1.016 long: 1 -8.89,0; 2 -6.35,0; 3 -3.81,0; 4 -1.27,0; 5 1.27,0; 6 3.81,0; 7 6.35,0; 8 8.89,0
2X18 = drill 1.016 octagon: 1 -21.59,-1.27; 2 -21.59,1.27; 3 -19.05,-1.27; 4 -19.05,1.27; 5 -16.51,-1.27; 6 -16.51,1.27; 7 -13.97,-1.27; 8 -13.97,1.27; 9 -11.43,-1.27; 10 -11.43,1.27; 11 -8.89,-1.27; 12 -8.89,1.27; 13 -6.35,-1.27; 14 -6.35,1.27; 15 -3.81,-1.27; 16 -3.81,1.27; 17 -1.27,-1.27; 18 -1.27,1.27; 19 1.27,-1.27; 20 1.27,1.27; 21 3.81,-1.27; 22 3.81,1.27; 23 6.35,-1.27; 24 6.35,1.27; 25 8.89,-1.27; 26 8.89,1.27; 27 11.43,-1.27; 28 11.43,1.27; 29 13.97,-1.27; 30 13.97,1.27; 31 16.51,-1.27; 32 16.51,1.27; 33 19.05,-1.27; 34 19.05,1.27; 35 21.59,-1.27; 36 21.59,1.27
RELAY_SRD-05VDC-SL-C = drill 1.32 square: A1 -6.1,6 | drill 1.32: A2 -6.1,-6; NC 6.1,6; NO 6.1,-6 | drill 1.29: COM -8.1,0
CUI_TB003-500-P04BE = drill 1.4 square: 1 0,0 | drill 1.4: 2 5,0; 3 10,0; 4 15,0
CHIPLED_0603 = smd 0.8 x 0.8: A 0,-0.75; C 0,0.75
DC-DC-STEP-DOWN-LM2596 = drill 1.5 pad 2.5 octagon: IN+ -19.812,8.636; IN- -19.812,-8.636; OUT+ 19.812,8.636; OUT- 19.812,-8.636
SOT23-R = smd 0.635 x 1.016: 1 -0.95,-1; 2 0.95,-1; 3 0,1
0402 = smd 0.7 x 0.9: 1 -0.65,0; 2 0.65,0
CUI_TB003-500-P08BE = drill 1.4 square: 1 0,0 | drill 1.4: 2 5,0; 3 10,0; 4 15,0; 5 20,0; 6 25,0; 7 30,0; 8 35,0
SW_1825255-1 = drill 0.902 square: 1 -1.1,4 | drill 0.902: 2 -1.1,0; 3 -1.1,-4 | drill 1.402: S1 3.1,7.5; S2 -3.1,-7.5
SW_B3F-1000 = drill 1 pad 1.6: 1 -3.25,2.25; 2 3.25,2.25; 3 -3.25,-2.25; 4 3.25,-2.25
SOIC254P1030X390-4N_EL817S1(A)(TU)-V = smd 1.41 x 1.47: 1 -4.85,1.27; 2 -4.85,-1.27; 3 4.85,-1.27; 4 4.85,1.27

### Placement (x,y rotation side)
C1  65.1,133.82 180 top
COIN  49.62,7.53 180 top
D1  105.16,130.57 270 top
D3  105.16,116.6 270 top
D5  105.16,102.63 270 top
D7  105.16,86.12 270 top
D9  105.16,69.61 270 top
D11  105.16,53.1 270 top
D13  105.16,36.59 270 top
D15  105.16,20.08 270 top
J1  5.99,131.39 90 top
J2  19.05,7.49 180 top
J4  5.99,115.7 90 top
J6  6.04,99.96 90 top
J8  6.14,84.17 90 top
J10  6.14,68.28 90 top
J12  6.24,52.39 90 top
J14  6.24,36.4 90 top
J16  6.24,20.47 90 top
J17  140.53,157.35 180 top
J18  129.53,157.35 180 top
J19  118.63,157.35 180 top
J20  107.64,157.35 180 top
J21  96.64,157.35 180 top
J22  85.75,157.35 180 top
J23  74.95,157.35 180 top
J24  64.05,157.35 180 top
J25  140.58,143.76 270 top
J26  140.58,126.67 270 top
J27  140.58,109.16 270 top
J28  140.58,91.65 270 top
J29  140.58,74.14 270 top
J30  140.58,56.63 270 top
J31  140.68,39.72 270 top
J32  140.68,22.51 270 top
JP1  83.82,99.08 270 top
JP2  83.82,78.76 270 top
JP3  83.82,55.9 270 top
JP4  35.59,105.43 90 top
JP5  35.56,83.84 90 top
JP6  35.54,60.98 90 top
JP7  57.15,43.2 0 top
K1  117.35,137.18 0 top
K3  117.35,120.67 0 top
K5  117.35,104.16 0 top
K7  117.35,87.65 0 top
K9  117.35,71.14 0 top
K11  117.35,54.63 0 top
K13  117.35,38.12 0 top
K15  117.35,21.61 0 top
LCD  3.48,157.1 0 top
LED1  102,127 270 top
LED2  102,113 270 top
LED3  103,98 270 top
LED4  103,81 270 top
LED5  101,15 270 top
LED6  103,32 270 top
LED7  103,48 270 top
LED8  102,65 270 top
LM2596_BUCK  44.45,23.38 0 top
Q2  101.86,116.35 270 top
Q3  101.86,130.32 270 top
Q5  101.86,102.38 270 top
Q7  101.86,85.87 270 top
Q9  101.86,69.36 270 top
Q11  101.86,52.85 270 top
Q13  101.86,36.34 270 top
Q15  101.86,19.83 270 top
R1  93.98,136.67 90 top
R2  109.99,148.86 270 top
R3  101.73,133.37 180 top
R4  103.89,148.86 270 top
R5  99.06,130.32 90 top
R6  97.79,148.86 270 top
R7  101.73,119.4 180 top
R8  99.06,116.35 90 top
R9  93.98,122.7 90 top
R10  91.7,148.86 270 top
R11  85.6,148.86 270 top
R12  79.51,148.86 270 top
R13  101.73,105.43 180 top
R14  99.06,102.38 90 top
R15  93.98,108.73 90 top
R16  73.41,148.86 270 top
R17  67.31,148.86 270 top
R18  98,127 180 top
R19  101.73,88.92 180 top
R20  99.06,85.87 90 top
R21  93.98,92.22 90 top
R22  98,113 180 top
R23  99,98 180 top
R24  99,81 180 top
R25  101.73,72.41 180 top
R26  99.06,69.36 90 top
R27  93.98,75.71 90 top
R28  97,15 180 top
R29  99,32 180 top
R30  99,48 180 top
R31  101.73,55.9 180 top
R32  99.06,52.85 90 top
R33  93.98,59.2 90 top
R34  98,65 180 top
R35  64.98,135.65 180 top
R37  101.73,39.39 180 top
R38  99.06,36.34 90 top
R39  93.98,42.69 90 top
R43  101.73,22.88 180 top
R44  99.19,21.22 90 top
R45  93.6,29.23 270 top
RFID  102.13,7.61 180 top
S1  30.92,156.73 270 top
S2  21,139 180 top
S3  21,123 180 top
S4  21,108 180 top
S5  21,92 180 top
S6  60.2,142.21 180 top
U1  100.84,137.18 0 top
U3  100.84,123.21 0 top
U5  100.84,109.24 0 top
U7  100.84,92.73 0 top
U9  100.84,76.22 0 top
U11  100.84,59.71 0 top
U13  100.84,43.2 0 top
U15  100.84,26.69 0 top

### Tracks (layer width: path | path; a pad name or v marks a point on that pad's centre or on a via)
3.3V
  Bottom 0.381: JP1.2 74.05,102.89 69.85,98.69 69.85,10.33 RFID.8
5V  (via drill 0.41)  (1 unrouted)
  Top 0.254: D5.1 106.17,104.78 106.43,105.05 106.43,106.31 107.06,106.95 109.61,106.95 111.25,108.6 K5.A1 110.9,110.51 U5.4 99.84,110.51 R22.2 | D7.1 106.17,88.27 106.43,88.53 106.43,89.81 107.06,90.44 109.61,90.44 111.25,92.09 K7.A1 110.9,94 U7.4 102.35,94 R23.2 | D9.1 106.17,71.76 106.43,72.03 106.43,73.3 107.06,73.93 109.61,73.93 111.25,75.58 K9.A1 110.9,77.49 U9.4 101.86,77.49 R24.2 | D11.1 106.17,55.25 106.43,55.52 106.43,56.78 107.06,57.42 109.61,57.42 111.25,59.07 K11.A1 110.9,60.98 U11.4 101.37,60.98 R34.2 | K15.A1 110.9,27.96 U15.4 102.39,27.96 R29.2 | D15.1 106.17,22.23 106.43,22.5 106.43,23.77 107.06,24.4 109.61,24.4 111.25,26.05 K15.A1 | D13.1 106.17,38.74 106.43,39 106.43,40.28 107.06,40.91 109.61,40.91 111.25,42.56 K13.A1 110.9,44.47 U13.4 101.88,44.47 R30.2 | R18.2 99.87,124.48 U3.4 | R28.2 98.46,12.89 112.6,12.89 114.43,14.72 114.43,25.09 111.91,27.61 K15.A1 | v66.48,137.25 66.48,136.5 R35.1
  Top 0.381: D1.1 106.55,132.72 107.19,133.37 107.19,137.94 106.68,138.45 U1.4 105.69,142.28 106.59,143.18 K1.A1 111.25,147.59 110.84,148.01 R2.2 | K3.A1 106.59,126.67 105.69,125.77 U3.4 106.68,124.48 107.19,123.97 107.19,119.4 106.55,118.75 D3.1 | R17.2 66.26,148.01 66.04,148.22 v66.04,149.37 | R16.2 74.21,148.01 74.68,148.48 v74.68,149.37 | R12.2 80.18,148.01 80.62,148.45 v80.62,149.37 | R11.2 86.78,148.01 87.25,148.48 v87.25,149.37 | R10.2 92.75,148.01 92.97,148.22 v92.97,149.37 | R6.2 98.98,148.01 99.32,148.35 v99.32,149.37 | R4.2 104.82,148.01 105.03,148.22 v105.03,149.37
  Top 0.762: K15.A1 114.46,27.61 115.57,28.72 115.57,45.23 | K1.A1 114.27,143.18 115.57,141.88 115.57,127.78 | 115.57,45.23 115.57,61.74 | 115.57,61.74 115.57,78.25 | 115.57,78.25 115.57,94.76 | 115.57,94.76 115.57,111.27 | 115.57,111.27 115.57,127.78 | K3.A1 114.46,126.67 115.57,127.78 | K5.A1 114.46,110.16 115.57,111.27 | K7.A1 114.46,93.65 115.57,94.76 | K9.A1 114.46,77.14 115.57,78.25 | K11.A1 114.46,60.63 115.57,61.74 | K13.A1 114.46,44.12 115.57,45.23 | v83.95,32.02 LM2596_BUCK.OUT+ 37.09,32.02 35.56,33.54 JP7.1 JP7.2
  Bottom 0.254: v66.48,137.25 65.46,138.27 65.46,149.37
  Bottom 0.762: K1.A1 111.25,147.34 109.22,149.37 v105.03,149.37 v99.32,149.37 v92.97,149.37 v87.25,149.37 v80.62,149.37 v74.68,149.37 v66.04,149.37 65.46,149.37 | 65.28,149.37 63.85,149.37 50.83,162.38 18.76,162.38 LCD.3 | JP1.3 89.54,100.35 93.48,96.41 109.22,96.41 111.25,94.38 K7.A1 | v83.95,32.02 95.51,32.02 99.92,27.61 K15.A1
12V
  Bottom 0.635: COIN.3 38.69,8.46 38.69,25.54 32.21,32.02 LM2596_BUCK.IN+
  Bottom 1.016: LM2596_BUCK.IN+ 19.05,26.43 J2.1
B1
  Top 0.254: JP7.28 68.58,136.64 62.85,142.38 18.88,142.38 S2.4 6.11,141.25 5.99,141.37 J1.3
B2
  Top 0.254: JP7.26 66.04,115.89 55.55,126.38 18.88,126.38 S3.4 17.3,125.7 J4.3
B3
  Top 0.254: JP7.24 63.5,108.8 59.21,113.1 19.11,113.1 17.75,111.74 S4.4 17.46,109.96 J6.3
B4
  Top 0.254: JP7.22 60.96,94.1 57.08,97.98 19.71,97.98 17.75,96.02 S5.4 6.22,94.25 J8.3
B5
  Top 0.254: 58.42,74.82 58.42,74.77 | 58.42,74.77 JP7.20 | 58.42,74.77 51.97,81.22 9.08,81.22 J10.3
B6
  Top 0.254: JP7.18 56.01,44.59 56.01,64.79 52.3,68.49 12.34,68.49 J12.3
B7
  Top 0.254: JP7.16 53.34,48.94 46.41,55.87 15.71,55.87 J14.3
B8
  Top 0.254: JP7.14 50.8,47.13 47.6,50.33 26.1,50.33 J16.3
GND
  pour Top (isolate 0.381): -0.09,165.29 148.64,165.29 148.64,0.16 -0.09,0.16
  pour Bottom (isolate 0.381): -0.09,165.56 148.64,165.56 148.64,-0.11 -0.09,-0.11
L1
  Top 0.254: JP7.27 68.08,41.93 67.44,42.56 67.44,103.78 67.44,104.03 67.44,128.46 64.52,131.39 J1.1
L2
  Top 0.254: JP7.25 65.28,41.93 64.77,42.43 64.77,95.95 64.77,96.54 64.77,112.41 60,117.19 7.48,117.19 J4.1
L3
  Top 0.254: JP7.23 62.62,41.93 62.23,42.31 62.23,85.84 62.23,86.25 62.23,108.47 60.38,110.33 33.68,110.33 23.32,99.96 J6.1
L4
  Top 0.254: JP7.21 60.08,41.93 59.82,42.18 59.82,79.97 59.82,80.15 59.82,85.26 58.4,86.68 36.91,86.68 36.78,86.55 8.52,86.55 J8.1
L5
  Top 0.254: JP7.19 57.79,41.93 57.15,42.56 57.15,65.52 57.15,65.69 57.15,67.2 51.69,72.66 10.52,72.66 J10.1
L6
  Top 0.254: JP7.17 55.12,41.93 54.61,42.43 54.61,61.1 52.1,63.62 17.47,63.62 J12.1
L7
  Top 0.254: JP7.15 52.71,41.93 52.07,42.56 52.07,49.22 47.98,53.31 23.14,53.31 J14.1
L8
  Top 0.254: JP7.13 50.04,41.93 49.53,42.43 49.56,42.46 49.56,46.47 47.65,48.38 34.14,48.38 J16.1
N$1
  Top 0.254: U1.3 103,135.91 102.58,135.49 R3.1
N$2
  Top 0.254: R1.2 93.98,138.06 94.36,138.45 U1.1
N$3
  Bottom 2.032: J25.1 139.99,143.18 K1.NC
N$4
  Top 0.381: J17.2 120.81,149.71 R2.1 107.28,149.71 105.67,148.1 105.67,146.07 104.14,144.54 94.75,144.54 92.97,142.76 87.63,142.76 81.87,137 81.87,88.08 82.3,87.65 JP2.1
N$5
  Top 0.381: JP2.2 82.05,85.11 80.78,86.38 80.78,137.43 87.13,143.78 92.97,143.78 94.49,145.3 100.33,145.3 101.35,146.32 101.35,148.61 102.45,149.71 R4.1 107.97,153.79 121.03,153.79 124.53,157.28 J18.2
N$6
  Top 0.381: JP2.3 81.54,82.57 79.51,84.6 79.51,137.43 86.62,144.54 92.21,144.54 93.73,146.07 93.73,148.35 95.09,149.71 R6.1 103.32,155.24 111.52,155.24 J19.2
N$7
  Top 0.381: JP2.4 79.51,80.03 78.24,81.3 78.24,137.94 85.6,145.3 87.63,145.3 88.4,146.07 88.4,148.61 89.5,149.71 R10.1 96.64,154.65 100,154.65 102.64,157.28 J20.2
N$8
  Top 0.381: JP2.5 78.24,77.49 76.97,78.76 76.97,138.7 81.03,142.76 81.03,147.34 83.4,149.71 R11.1 91.64,155.75 J21.2
N$9
  Top 0.254: D1.2 105.16,129.56 104.4,130.32 Q3.3 102.86,127.11 LED1.C
  Top 0.381: D1.2 107.58,128.42 110.34,131.18 K1.A2
N$10
  Top 0.381: J22.2 79.51,154.96 R12.1 77.82,149.71 75.7,147.59 75.7,76.47 77.22,74.95 JP2.6
N$11
  Top 0.254: D3.2 105.16,115.59 104.4,116.35 Q2.3 102.86,113.11 LED2.C
  Top 0.381: D3.2 111.04,114.45 K3.A2
N$12
  Top 0.254: R8.2 99.16,117.3 Q2.1 100.88,117.32 R7.2
N$13
  Bottom 2.032: K3.NO 139.15,114.67 140.58,116.09 J26.3
N$14
  Top 0.254: U3.3 103,121.94 102.58,121.52 R7.1
N$15
  Top 0.254: R5.2 99.16,131.27 Q3.1 100.88,131.29 R3.2
N$16
  Top 0.254: R9.2 93.98,124.09 94.36,124.48 U3.1
N$17
  Bottom 2.032: K3.NC J26.1
N$18
  Bottom 2.032: J25.3 126.04,133.76 K1.NO
N$19
  Top 0.381: J23.2 73.41,153.89 R16.1 72.36,149.71 71.63,148.99 71.63,73.68 72.9,72.41 JP2.7
N$20
  Top 0.381: JP2.8 72.14,69.87 69.85,72.15 69.85,148.61 68.75,149.71 R17.1 59.68,157.35 J24.2
N$21
  Bottom 2.032: K5.NC 130.15,110.16 131.15,109.16 J27.1
N$22
  Bottom 2.032: K7.NC 130.15,93.65 132.15,91.65 J28.1
N$23
  Bottom 2.032: J25.2 119.58,138.76 117.99,137.18 K1.COM
N$24
  Bottom 2.032: J26.2 110.25,121.67 K3.COM
N$25
  Top 0.254: K5.A2 105.95,98.16 105.16,98.95 D5.2 105.16,101.62 104.4,102.38 Q5.3 103.75,101.49 LED3.C
N$26
  Top 0.254: R14.2 99.16,103.33 Q5.1 100.88,103.35 R13.2
N$27
  Bottom 2.032: J27.3 124.45,99.16 K5.NO
N$28
  Top 0.254: U5.3 103,107.97 102.58,107.55 R13.1
N$29
  Top 0.254: R15.2 93.98,110.12 94.36,110.51 U5.1
N$30
  Bottom 2.032: K15.NC 135.89,27.61 140.68,22.82 J32.1
N$31
  Bottom 2.032: J29.2 138.58,71.14 K9.COM
N$32
  Bottom 2.032: K11.COM 112.25,51.63 J30.2
N$33
  Bottom 2.032: J32.2 136.66,21.53 136.3,21.61 K15.COM
N$34
  Bottom 2.032: J31.2 138.68,36.72 110.65,36.72 K13.COM
N$35
  Bottom 2.032: J28.2 139.58,87.65 K7.COM
N$36
  Bottom 2.032: K5.COM J27.2
N$37
  Top 0.254: K7.A2 105.95,81.65 105.16,82.44 D7.2 105.16,85.11 104.4,85.87 Q7.3 103.75,84.98 LED4.C
N$38
  Top 0.254: R20.2 99.16,86.82 Q7.1 100.88,86.84 R19.2
N$39
  Bottom 2.032: K7.NO J28.3
N$40
  Top 0.254: U7.3 103,91.46 102.58,91.04 R19.1
N$41
  Top 0.254: R21.2 93.98,93.62 94.36,94 U7.1
N$42
  Bottom 2.032: K13.NC 136.3,44.12 140.68,39.73 J31.1
N$43
  Bottom 2.032: J30.1 127.45,56.63 K11.NC
N$44
  Bottom 2.032: K9.NC 137.72,77.14 140.58,74.28 J29.1
N$45
  Top 0.254: R22.1 LED2.A
N$46
  Top 0.254: R23.1 LED3.A
N$47
  Top 0.254: R24.1 LED4.A
N$48
  Top 0.254: LED5.A R28.1
N$49
  Top 0.254: K9.A2 105.95,65.14 105.16,65.93 D9.2 105.16,68.6 104.4,69.36 Q9.3 102.86,65.11 LED8.C
N$50
  Top 0.254: R26.2 99.16,70.31 Q9.1 100.88,70.33 R25.2
N$51
  Bottom 2.032: K9.NO 139.58,65.14 J29.3
N$52
  Top 0.254: U9.3 103,74.95 102.58,74.53 R25.1
N$53
  Top 0.254: R27.2 93.98,77.1 94.36,77.49 U9.1
N$54
  Top 0.254: LED6.A R29.1
N$55
  Top 0.254: LED7.A R30.1
N$56
  Top 0.254: LED8.A R34.1
N$57
  Top 0.254: LED1.A R18.1
N$61
  Top 0.254: K11.A2 105.95,48.63 105.16,49.42 D11.2 105.16,52.09 104.4,52.85 Q11.3 102.86,48.89 LED7.C
N$62
  Top 0.254: R32.2 99.16,53.8 Q11.1 100.88,53.82 R31.2
N$63
  Bottom 2.032: K11.NO 138.58,48.63 J30.3
N$64
  Top 0.254: U11.3 103,58.44 102.58,58.02 R31.1
N$65
  Top 0.254: R33.2 93.98,60.59 94.36,60.98 U11.1
N$73
  Top 0.254: K13.A2 105.95,32.12 105.16,32.91 D13.2 105.16,35.58 104.4,36.34 Q13.3 103.75,35.45 LED6.C
N$74
  Top 0.254: R38.2 99.16,37.29 Q13.1 100.88,37.31 R37.2
N$75
  Bottom 2.032: J31.3 138.28,32.12 K13.NO
N$76
  Top 0.254: U13.3 103,41.93 102.58,41.51 R37.1
N$77
  Top 0.254: R39.2 93.98,44.08 94.36,44.47 U13.1
N$85
  Top 0.254: K15.A2 105.95,15.61 105.16,16.4 D15.2 105.16,19.07 104.4,19.83 Q15.3 102.86,16.11 LED5.C
N$86
  Top 0.254: Q15.1 100.88,20.8 R43.2 100.75,23 99.7,23 99.19,22.5 R44.2
N$87
  Bottom 2.032: J32.3 137.58,15.61 K15.NO
N$88
  Top 0.254: U15.3 103,25.42 102.58,25 R43.1
N$89
  Top 0.254: R45.2 95.57,28.38 U15.1
RESET  (via drill 0.41)
  Top 0.254: v62.28,133.57 64,133.57 C1.2 64.33,133.9 R35.2 63.45,136.53 S6.1
  Bottom 0.254: JP1.1 62.28,126.97 v62.28,133.57
RFID_MISO
  Bottom 0.254: JP7.32 73.03,44.47 72.39,43.83 72.39,23.02 87.13,8.28 RFID.4
RFID_MOSI
  Bottom 0.254: JP7.31 73.66,23.77 87.19,10.24 89.5,10.24 RFID.3
RFID_RST
  Bottom 0.254: JP7.29 71.12,8.61 RFID.7
RFID_SCK
  Bottom 0.254: JP7.34 75.82,44.47 74.93,43.58 74.93,25.15 87.84,12.24 91.28,12.24 95.92,7.61 RFID.2
RFID_SS
  Bottom 0.254: JP7.33 76.2,24.91 87.84,13.27 95.08,13.27 100.75,7.61 RFID.1
RL1
  Top 0.254: JP7.11 48.26,40.53 49.28,39.51 83.57,39.51 87.13,43.07 87.13,133.87 89.07,135.82 R1.1
RL2
  Top 0.254: JP7.12 47.63,44.47 46.99,43.83 46.99,40.28 48.52,38.75 83.7,38.75 87.76,42.81 87.76,119.4 90.21,121.85 R9.1
RL3
  Top 0.254: R15.1 89.45,107.88 88.4,106.82 88.4,42.43 83.95,37.99 46.87,37.99 45.72,39.13 JP7.9
RL4
  Top 0.254: JP7.10 45.09,44.47 44.45,43.83 44.45,39 46.1,37.35 84.33,37.35 89.03,42.05 89.03,90.06 90.34,91.37 R21.1
RL5
  Top 0.254: R27.1 90.72,74.86 89.67,73.8 89.67,41.55 84.84,36.72 44.71,36.72 43.18,38.24 JP7.7
RL6
  Top 0.254: JP7.8 42.68,44.47 41.91,43.7 41.91,37.99 43.95,35.96 85.09,35.96 90.3,41.16 90.3,57.55 91.1,58.35 R33.1
RL7
  Top 0.254: R39.1 92.12,41.84 85.73,35.45 41.91,35.45 40.64,36.72 JP7.5
RL8
  Top 0.254: JP7.6 40.14,44.47 39.37,43.7 39.37,36.08 40.64,34.81 91.7,34.81 93.6,32.91 R45.1
RX1
  Bottom 0.254: JP6.3 64.01,57.17 67.31,53.86 67.31,41.85 67.31,41.71 67.31,39.82 49.51,22.01 49.51,7.64 COIN.1
SCL
  Bottom 0.381: JP6.1 31.5,52.09 19.44,64.15 19.44,141.93 4.26,157.1 LCD.1
SDA
  Bottom 0.381: JP6.2 32.47,54.63 22.61,64.48 22.61,143.08 8.59,157.1 LCD.2
TX1
  Bottom 0.381: JP6.4 33.2,59.71 26.67,66.23 26.67,157.58 S1.3

### Text on the board
tPlace: 1 | 0 | G | G | G | 8 | 7 | 6 | 5 | 4 | 3 | 2 | 1 | RESET | + | 1 | - | 2 | 3 | << | 4 | 5 | 6 | 7 | 8
tNames: G | G | G | G | G | SCL | SDA | 5V | G | G | G | G | PAUSE BUTTON | B1 | G | C | L1 | A | B2 | FM-08 | G | C | L2 | A | B3 | GETTONIERE-SHOP | G | C | A | L3 | ACTIVE BUTTON | B4 | MEGA | G | C | L4 | A | B5 | G | C | L5 | A | B6 | G | C | L6 | A | B7 | G | C | L7 | A | B8 | G | C | L8 | A | G | 12V | 12V | G | PULSE | 3.3V | RST | G | MISO | MOSI | SCK | SS